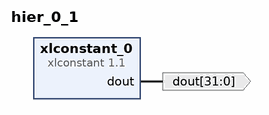
[diagram p0: block diagram of the top level]
# Vivado block design hier_0_1, xck26-sfvc784-2LV-c, Vivado 2023.2
create_bd_design hier_0_1

create_bd_port -dir O -from 31 -to 0 dout

create_bd_cell -type ip -vlnv xilinx.com:ip:xlconstant:1.1 xlconstant_0
set_property -dict {CONFIG.CONST_VAL 49 CONFIG.CONST_WIDTH 32} [get_bd_cells xlconstant_0]

# ---- connections ----

connect_bd_net [get_bd_pins xlconstant_0/dout] [get_bd_ports dout]

validate_bd_design
save_bd_design
